# EAGLE design main (EAGLE 5.11)

## Sheet 1 of 2
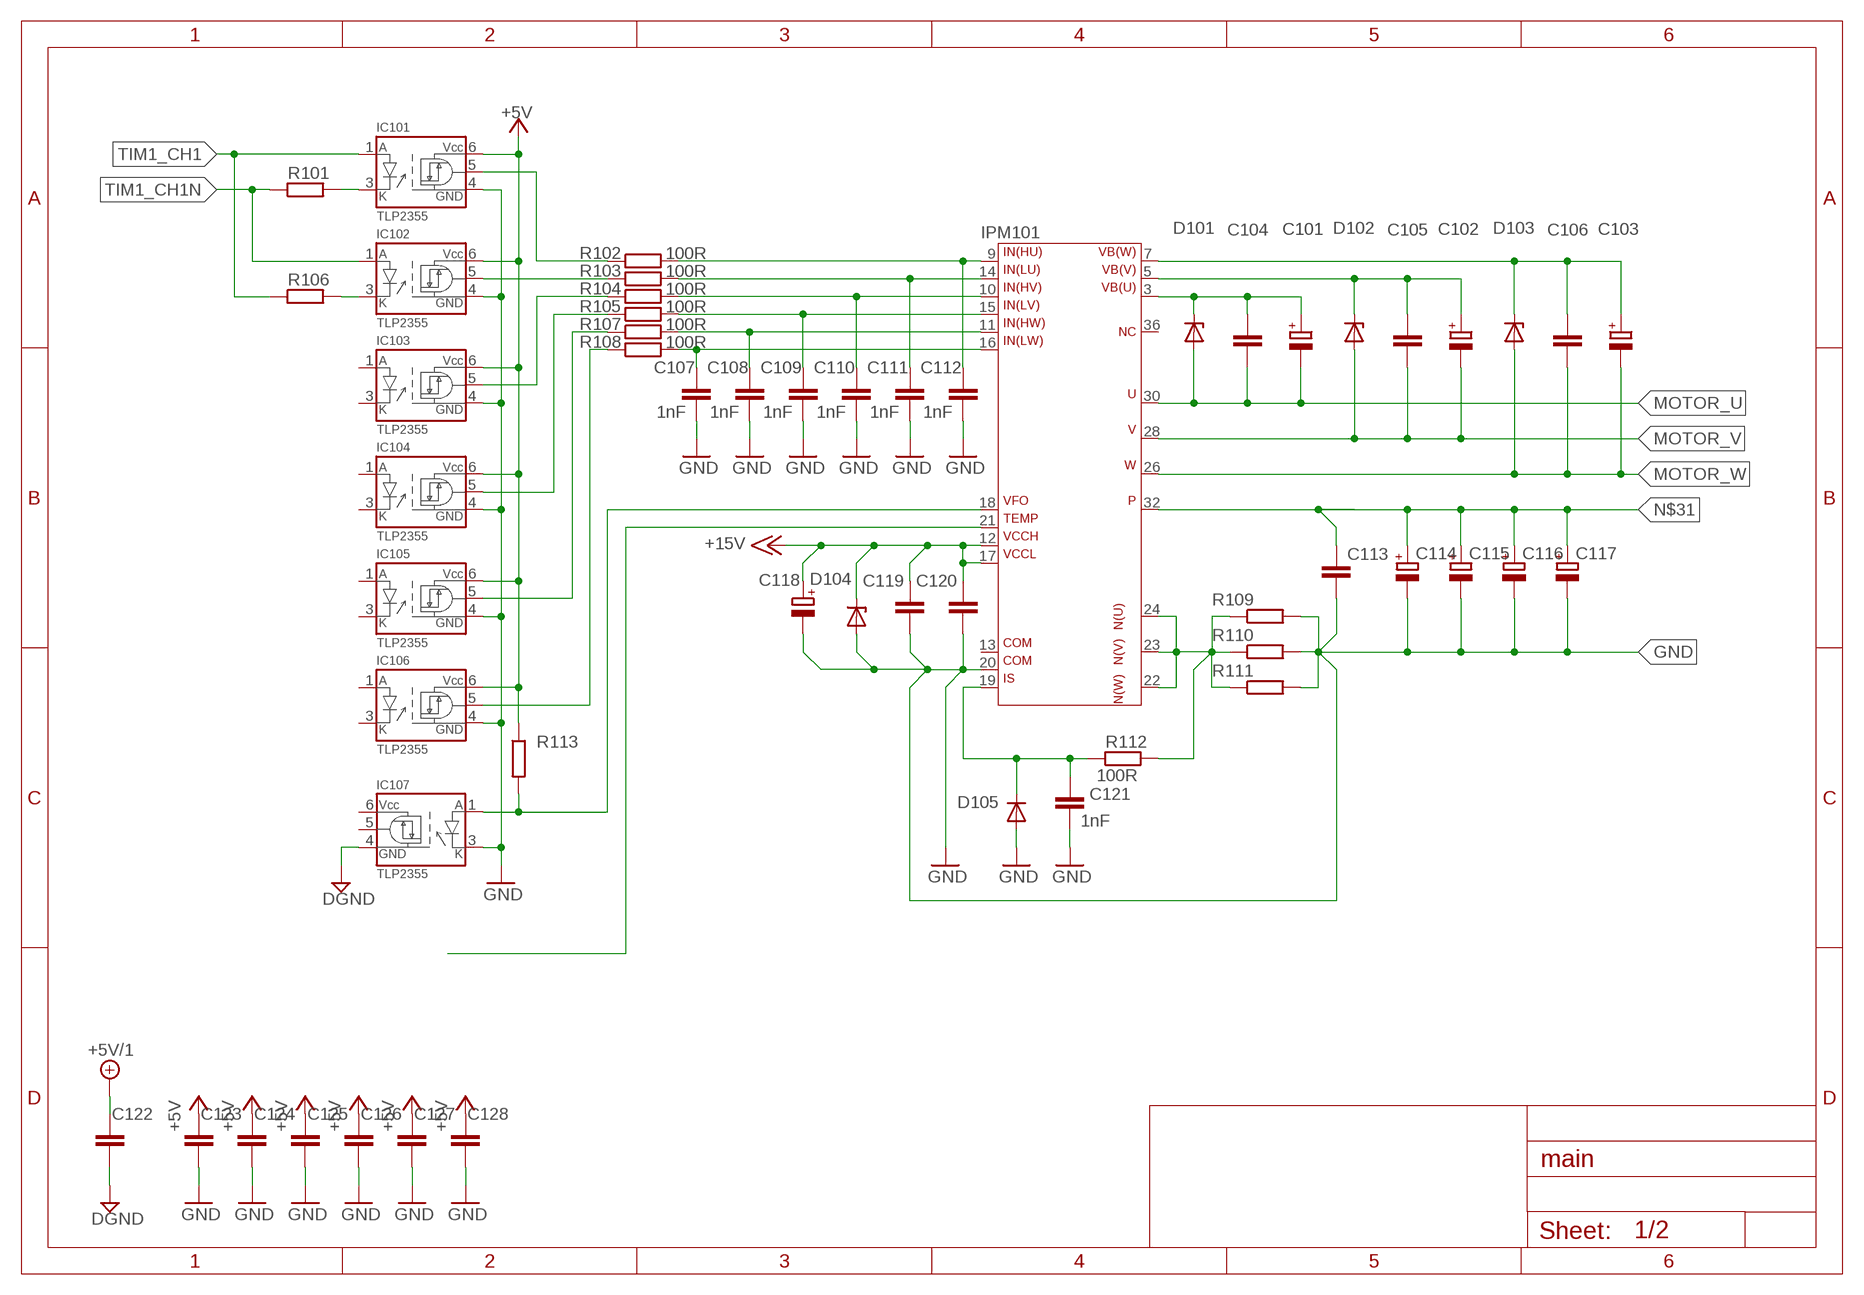
[diagram p0: schematic, sheet 1]

### Parts
C101  CPOL-EU153CLV-0405  [153CLV-0405]
C102  CPOL-EU153CLV-0405  [153CLV-0405]
C103  CPOL-EU153CLV-0405  [153CLV-0405]
C104  C-EUC0805  [C0805]
C105  C-EUC0805  [C0805]
C106  C-EUC0805  [C0805]
C107  1nF  C-EUC0805  [C0805]
C108  1nF  C-EUC0805  [C0805]
C109  1nF  C-EUC0805  [C0805]
C110  1nF  C-EUC0805  [C0805]
C111  1nF  C-EUC0805  [C0805]
C112  1nF  C-EUC0805  [C0805]
C113  C-EU225-062X268  [C225-062X268]
C114  CPOL-EUE10-22.5  [EB22,5D]
C115  CPOL-EUE10-22.5  [EB22,5D]
C116  CPOL-EUE10-22.5  [EB22,5D]
C117  CPOL-EUE10-22.5  [EB22,5D]
C118  CPOL-EU153CLV-0405  [153CLV-0405]
C119  C-EUC0805  [C0805]
C120  C-EUC0805  [C0805]
C121  1nF  C-EUC0805  [C0805]
C122  C-EUC0805  [C0805]
C123  C-EUC0805  [C0805]
C124  C-EUC0805  [C0805]
C125  C-EUC0805  [C0805]
C126  C-EUC0805  [C0805]
C127  C-EUC0805  [C0805]
C128  C-EUC0805  [C0805]
D101  ZENER-DIODESOD80C  [SOD80C]
D102  ZENER-DIODESOD80C  [SOD80C]
D103  ZENER-DIODESOD80C  [SOD80C]
D104  ZENER-DIODESOD80C  [SOD80C]
D105  DIODE-SOD123  [SOD123]
IC101  TLP2355  [11-4L1S]
IC102  TLP2355  [11-4L1S]
IC103  TLP2355  [11-4L1S]
IC104  TLP2355  [11-4L1S]
IC105  TLP2355  [11-4L1S]
IC106  TLP2355  [11-4L1S]
IC107  TLP2355  [11-4L1S]
IPM101  6MBP  [6MBPXXXSD060-50]
R101  R-EU_R0805  [R0805]
R102  100R  R-EU_R0805  [R0805]
R103  100R  R-EU_R0805  [R0805]
R104  100R  R-EU_R0805  [R0805]
R105  100R  R-EU_R0805  [R0805]
R106  R-EU_R0805  [R0805]
R107  100R  R-EU_R0805  [R0805]
R108  100R  R-EU_R0805  [R0805]
R109  R-EU_R6332W  [R6332W]
R110  R-EU_R6332W  [R6332W]
R111  R-EU_R6332W  [R6332W]
R112  100R  R-EU_R0805  [R0805]
R113  R-EU_R0805  [R0805]

### Nets
+5V: C123.1 C124.1 C125.1 C126.1 C127.1 C128.1 IC101.6(VCC) IC102.6(VCC) IC103.6(VCC) IC104.6(VCC) IC105.6(VCC) IC106.6(VCC) R113.1
+5V/1: C122.1
+15V: C118.+ C119.1 C120.1 D104.C IPM101.12 IPM101.17
DGND: C122.2 IC107.4(GND)
GND: C107.2 C108.2 C109.2 C110.2 C111.2 C112.2 C113.2 C114.- C115.- C116.- C117.- C118.- C119.2 C120.2 C121.2 C123.2 C124.2 C125.2 C126.2 C127.2 C128.2 D104.A D105.A IC101.4(GND) IC102.4(GND) IC103.4(GND) IC104.4(GND) IC105.4(GND) IC106.4(GND) IC107.3(K) IPM101.20 R109.2 R110.2 R111.2
MOTOR_U: C101.- C104.1 D101.A IPM101.30
MOTOR_V: C102.- C105.1 D102.A IPM101.28
MOTOR_W: C103.- C106.1 D103.A IPM101.26
N$7: C101.+ C104.2 D101.C IPM101.3
N$29: C102.+ C105.2 D102.C IPM101.5
N$30: C103.+ C106.2 D103.C IPM101.7
N$31: C113.1 C114.+ C115.+ C116.+ C117.+ IPM101.32
N$32: IC101.5(OUT) R102.1
N$33: IPM101.22 IPM101.23 IPM101.24 R109.1 R110.1 R111.1 R112.2
N$34: IC102.5(OUT) R103.1
N$35: C121.1 D105.C IPM101.19 R112.1
N$36: IC103.5(OUT) R104.1
N$37: IC104.5(OUT) R105.1
N$38: IC105.5(OUT) R107.1
N$39: IC106.5(OUT) R108.1
N$42: IPM101.21
N$45: IC101.3(K) R101.2
N$46: IC102.3(K) R106.2
N$47: C112.1 IPM101.9 R102.2
N$48: C111.1 IPM101.14 R103.2
N$49: C110.1 IPM101.10 R104.2
N$50: C109.1 IPM101.15 R105.2
N$51: C108.1 IPM101.11 R107.2
N$52: C107.1 IPM101.16 R108.2
N$53: IC107.1(A) IPM101.18 R113.2
TIM1_CH1: IC101.1(A) R106.1
TIM1_CH1N: IC102.1(A) R101.1
Unconnected: IC103.1(A) IC103.3(K) IC104.1(A) IC104.3(K) IC105.1(A) IC105.3(K) IC106.1(A) IC106.3(K) IC107.5(OUT) IC107.6(VCC) IPM101.36

## Sheet 2 of 2
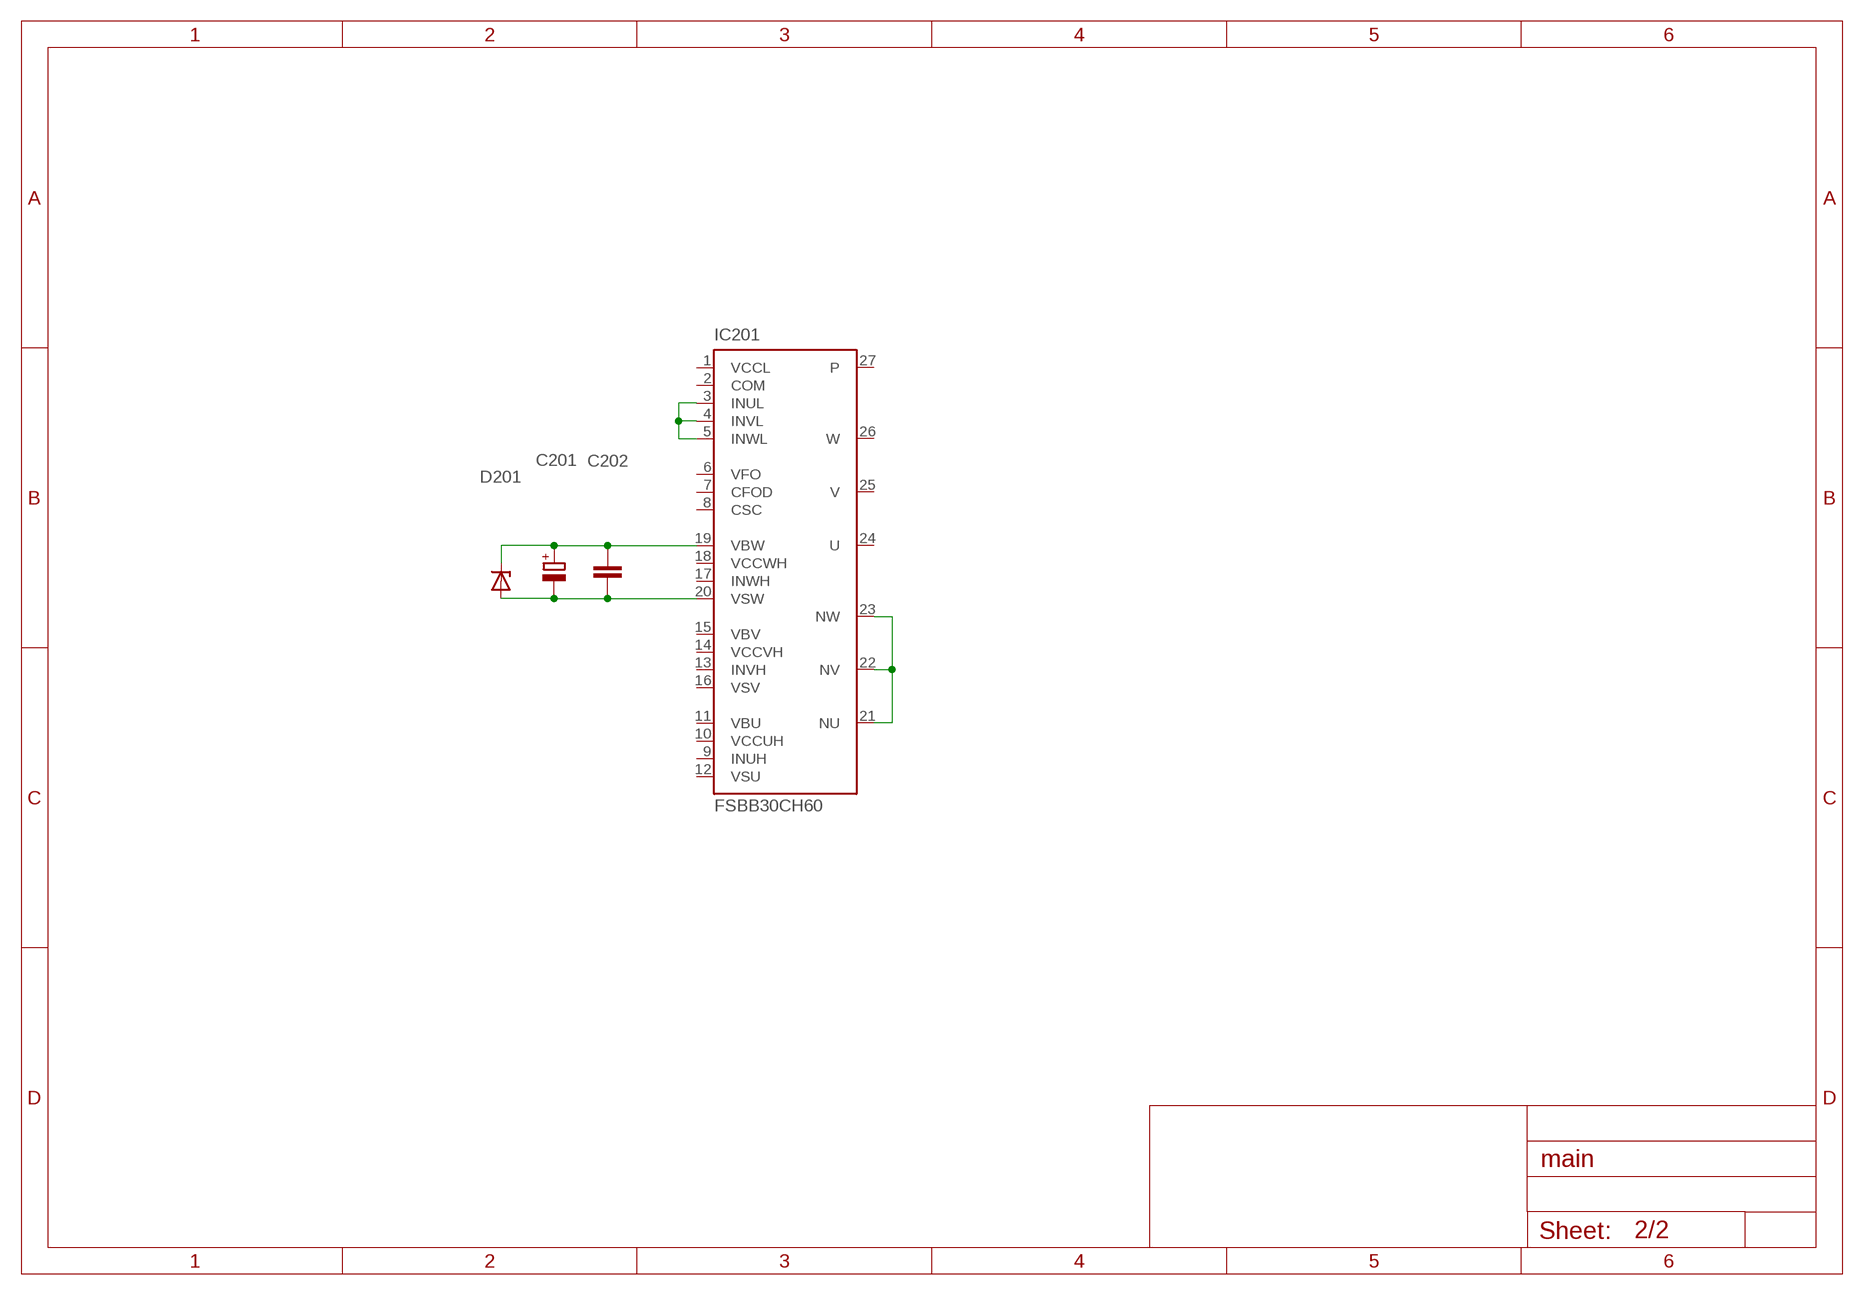
[diagram p1: schematic, sheet 2]

### Parts
C201  CPOL-EU153CLV-0405  [153CLV-0405]
C202  C-EUC0805  [C0805]
D201  ZENER-DIODESOD80C  [SOD80C]
IC201  FSBB30CH60  [FSBB30CH60]

### Nets
N$10: IC201.21(NU) IC201.22(NV) IC201.23(NW)
N$23: IC201.3(INUL) IC201.4(INVL) IC201.5(INWL)
N$24: C201.- C202.1 D201.A IC201.20(VSW)
N$25: C201.+ C202.2 D201.C IC201.19(VBW)
Unconnected: IC201.6(VFO) IC201.7(CFOD) IC201.8(CSC) IC201.9(INUH) IC201.10(VCCUH) IC201.11(VBU) IC201.12(VSU) IC201.13(INVH) IC201.14(VCCVH) IC201.15(VBV) IC201.16(VSV) IC201.17(INWH) IC201.18(VCCWH) IC201.24(U) IC201.25(V) IC201.26(W) IC201.27(P)

## Power pins joined to a net without a drawn wire
13: IPM101.13
COM: IC201.2(COM)
VCCL: IC201.1(VCCL)

## Library data of the parts
C101-C103 C114-C118 C201 = rcl:CPOL-EU: POLARIZED CAPACITOR, European symbol
C104-C113 C119-C128 C202 = rcl:C-EU: CAPACITOR, European symbol
D101-D104 D201 = diode:ZENER-DIODE: Z-Diode
D105 = diode:DIODE-: DIODE
IC101-IC107 = myToshiba:TLP2355
IC201 = fairchild-semic:FSBB30CH60: Smart Power Module 600V-30A IGBT inverter for three-phase DC/AC power conversion Source: http://www.fairchildsemi.com/ds/FS/FSBB30CH60.pdf; MPN: FSBB30CH60B; OC_FARNELL: 1783234; OC_NEWARK: 78M1076
IPM101 = myFujiElectric:6MBP
R101-R113 = rcl:R-EU_: RESISTOR, European symbol

## Board
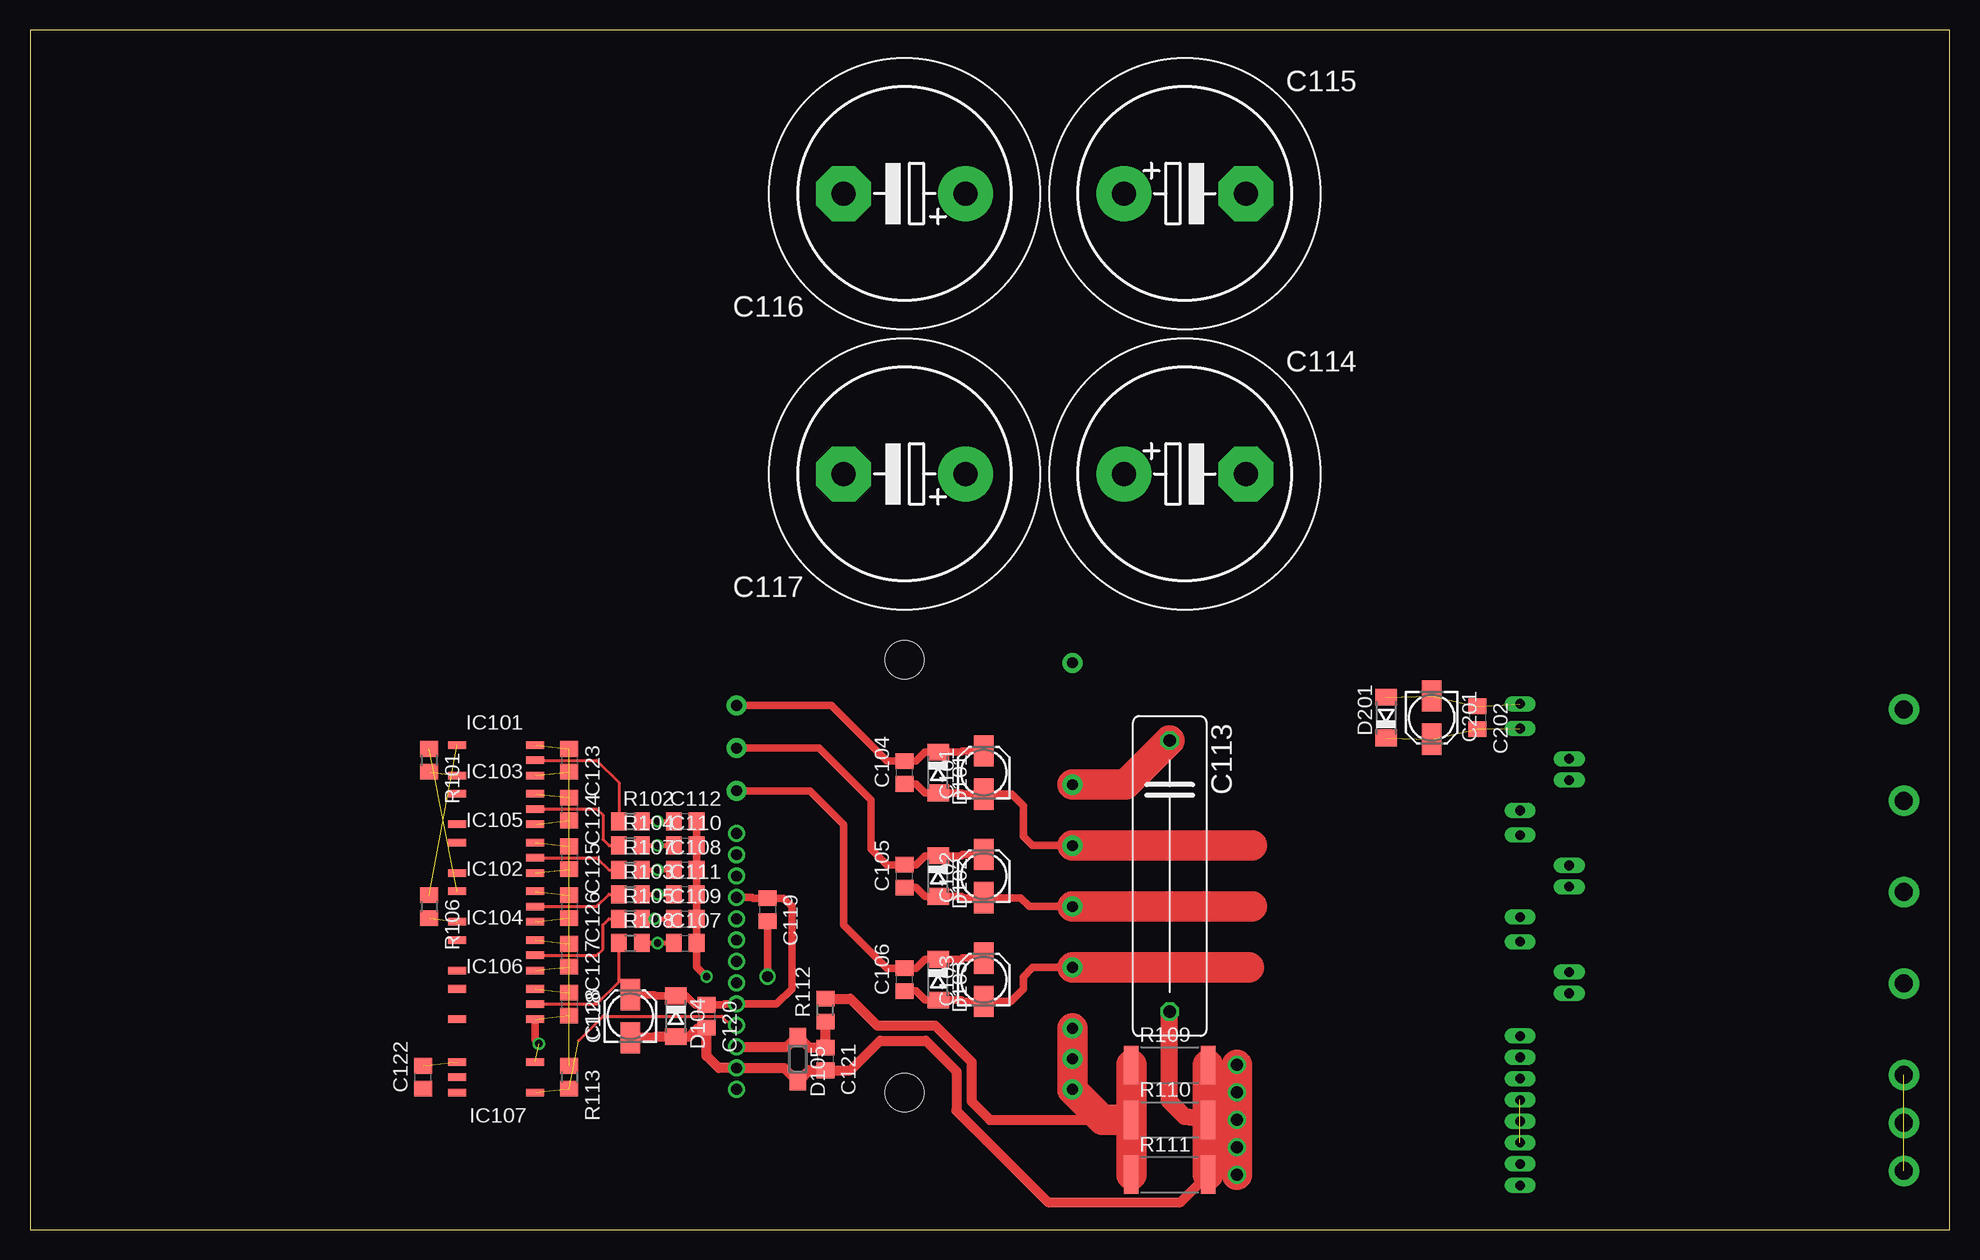
[diagram p2: board, top side]
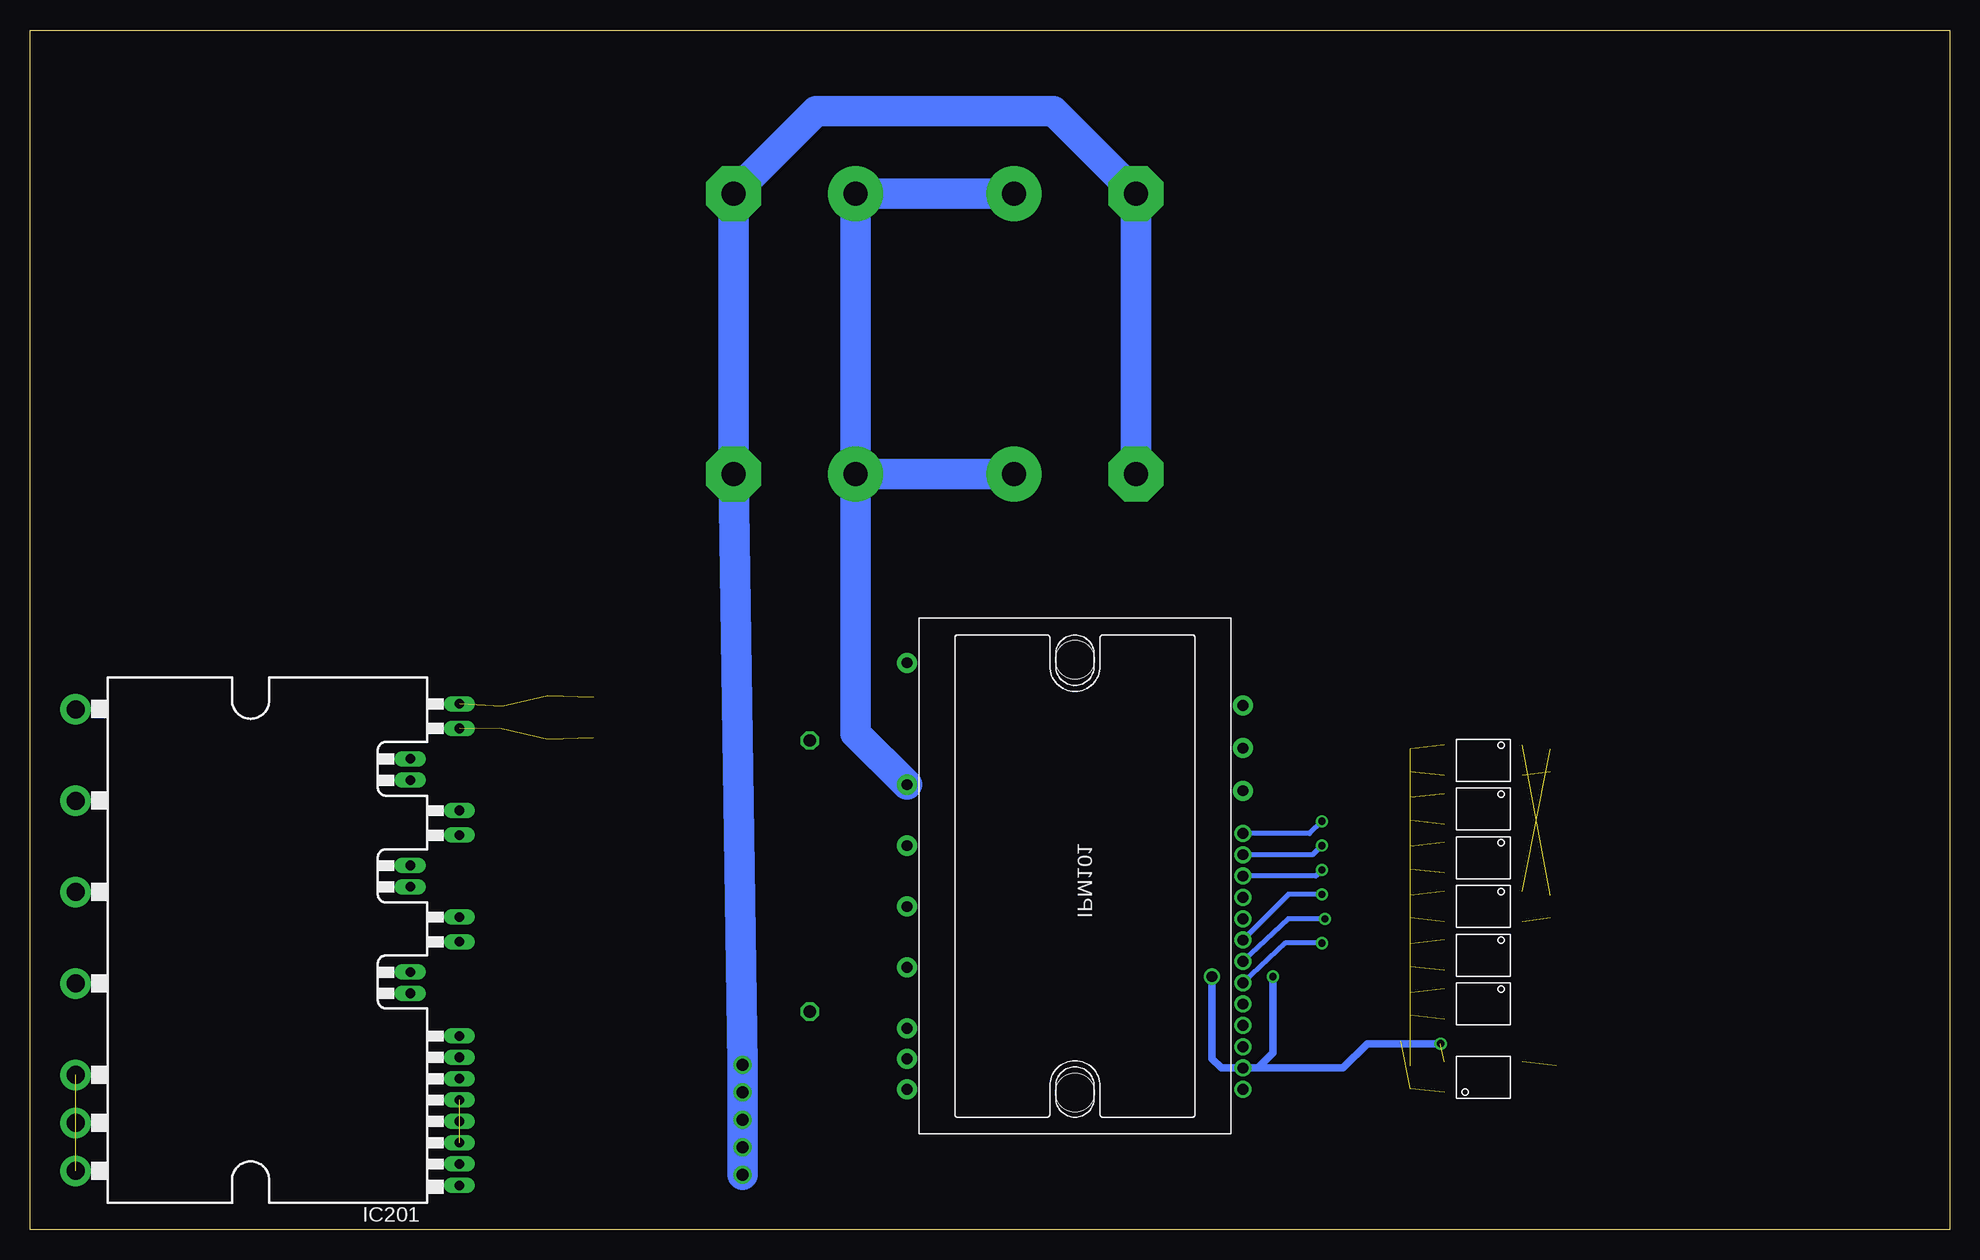
[diagram p3: board, bottom side, seen from below]

Size 160 x 100 mm. Coordinates in mm from the lower left corner, seen from the top.
Outline: 0,0 160,0 160,100 0,100 0,0
Copper layers (1*16): Top 0.035mm / dielectric 1.5mm / Bottom 0.035mm
Design rules "default": minimum track width 10mil, minimum drill 24mil, track to track 8mil, track to pad 8mil, pad to pad 8mil, via to via 8mil, smd to smd 8mil, copper to edge 40mil, drill to drill 8mil, minimum pad ring 10mil, minimum via ring 8mil, stop-mask expansion 4mil, vias tented up to drill 0mil, thermal gap 10mil
Holes 3.2 mm at 72.9,11.43 72.9,47.5

### Footprints (pad centres in the part's own frame; a part is rotated, then mirrored left to right if it is on the bottom)
153CLV-0405 = smd 2.6 x 1.6: + 1.8,0; - -1.8,0
C0805 = smd 1.3 x 1.5: 1 -0.95,0; 2 0.95,0
C225-062X268 = drill 1.016 octagon: 1 -11.303,0; 2 11.303,0
EB22,5D = drill 2.007 pad 4.597 round: + -5.08,0 | drill 2.007 pad 4.597 octagon: - 5.08,0
SOD80C = smd 1.4 x 1.8: A 1.7,0; C -1.7,0
SOD123 = smd 1.4 x 1.4: A 1.9,0; C -1.9,0
11-4L1S = smd 0.635 x 1.5: 1 -1.27,-3.25; 3 1.27,-3.25; 4 1.27,3.25; 5 0,3.25; 6 -1.27,3.25
FSBB30CH60 = drill 0.8 pad 1.27 long: 1 -20.447,-16; 2 -18.669,-16; 3 -16.891,-16; 4 -15.113,-16; 5 -13.335,-16; 6 -11.557,-16; 7 -9.779,-16; 8 -8.001,-16; 9 -4.445,-11.9; 10 -2.667,-11.9; 11 -0.136,-16; 12 1.914,-16; 13 4.445,-11.9; 14 6.223,-11.9; 15 8.754,-16; 16 10.804,-16; 17 13.335,-11.9; 18 15.113,-11.9; 19 17.644,-16; 20 19.694,-16 | drill 1.5 pad 2.54 round: 21 -19.24,16; 22 -15.24,16; 23 -11.24,16; 24 -3.62,16; 25 4,16; 26 11.62,16; 27 19.24,16
6MBPXXXSD060-50 = drill 0.9 pad 1.676 round: 3 14.224,14; 5 10.668,14; 7 7.112,14; 22 -17.78,-14; 23 -15.24,-14; 24 -12.7,-14; 26 -7.62,-14; 28 -2.54,-14; 30 2.54,-14; 32 7.62,-14; 36 17.78,-14 | drill 0.9 pad 1.422 round: 9 3.556,14; 10 1.778,14; 11 0,14; 12 -1.778,14; 13 -3.556,14; 14 -5.334,14; 15 -7.112,14; 16 -8.89,14; 17 -10.668,14; 18 -12.446,14; 19 -14.224,14; 20 -16.002,14; 21 -17.78,14
R0805 = smd 1.3 x 1.5: 1 -0.95,0; 2 0.95,0
R6332W = smd 1.2 x 3.2: 1 -3.196,0; 2 3.196,0

### Placement (x,y rotation side)
C101  79.5,38.1 90 top
C102  79.5,29.46 90 top
C103  79.5,20.83 90 top
C104  72.9,38.1 90 top
C105  72.9,29.46 90 top
C106  72.9,20.83 90 top
C107  54.61,23.88 0 top
C108  54.61,29.97 0 top
C109  54.61,25.91 0 top
C110  54.61,32 0 top
C111  54.61,27.94 0 top
C112  54.61,34.04 0 top
C113  95,29.46 270 top
C114  96.27,62.99 0 top
C115  96.27,86.36 0 top
C116  72.9,86.36 180 top
C117  72.9,62.99 180 top
C118  50.04,17.78 90 top
C119  61.47,26.67 270 top
C120  56.39,17.78 270 top
C121  66.29,14.22 270 top
C122  32.77,12.7 90 top
C123  44.96,39.12 270 top
C124  44.96,35.05 270 top
C125  44.96,30.99 270 top
C126  44.96,26.92 270 top
C127  44.96,22.86 270 top
C128  44.96,18.8 270 top
C201  116.84,42.67 270 top
C202  120.65,42.67 270 top
D101  75.69,38.1 270 top
D102  75.69,29.46 270 top
D103  75.69,20.83 270 top
D104  53.85,17.78 270 top
D105  64.01,14.22 270 top
D201  113.03,42.67 90 top
IC101  38.86,39.12 270 top
IC102  38.86,26.92 270 top
IC103  38.86,35.05 270 top
IC104  38.86,22.86 270 top
IC105  38.86,30.99 270 top
IC106  38.86,18.8 270 top
IC107  38.86,12.7 90 top
IC201  140.21,24.13 90 bottom
IPM101  72.9,29.46 90 top
R101  33.27,39.12 270 top
R102  50.04,34.04 0 top
R103  50.04,27.94 0 top
R104  50.04,32 0 top
R105  50.04,25.91 0 top
R106  33.27,26.92 270 top
R107  50.04,29.97 0 top
R108  50.04,23.88 0 top
R109  95,13.72 0 top
R110  95,9.14 0 top
R111  95,4.57 0 top
R112  66.29,18.29 90 top
R113  44.96,12.7 270 top

### Tracks (layer width: path | path; a pad name or v marks a point on that pad's centre or on a via)
+5V  (12 unrouted)
+15V
  Top 0.61: C118.+ 52.05,19.58 52.15,19.48 D104.C 54.69,19.48 55.44,18.73 C120.1 57.85,18.73 57.91,18.8 IPM101.17 62.23,18.8 63.5,20.07 63.5,26.92 62.8,27.62 C119.1 60.26,27.62 60.2,27.69 IPM101.12
DGND  (1 unrouted)
GND  (via drill 0.6, 0.9, 1)  (12 unrouted)
  Top 0.61: v56.39,21.08 55.56,21.91 C107.2 C109.2 C111.2 C108.2 C110.2 C112.2 | IC106.4 42.11,15.8 v42.42,15.49 | v61.47,21.08 C119.2
  Top 0.813: 56.39,16.76 C120.2 | C118.- 52.05,15.98 52.15,16.08 D104.A 54.94,16.08 55.63,16.76 56.39,16.76 | 56.39,16.76 56.39,14.48 57.4,13.46 IPM101.20 62.87,13.46 D105.A 64.96,13.27 C121.2 68.39,13.27 70.87,15.75 74.68,15.75 77.22,13.21 77.22,9.91 84.84,2.29 95.91,2.29 R111.2
  Top 1.422: C113.2 95,10.67 96.27,9.4 R110.2 v100.58,9.14
  Top 2.54: v100.58,13.72 v100.58,9.14 v100.58,4.57 | R109.2 R110.2 R111.2
  Bottom 0.61: v56.39,21.08 56.39,14.73 57.66,13.46 | v42.42,15.49 48.51,15.49 50.55,13.46 57.66,13.46 | 57.66,13.46 IPM101.20 60.71,13.46 61.47,14.22 v61.47,21.08
  Bottom 2.54: C117.- C116.- 74.68,93.22 94.49,93.22 C115.- C114.- v100.58,13.72 v100.58,11.43 v100.58,9.14 v100.58,6.86 v100.58,4.57
MOTOR_U
  Top 0.61: IPM101.30 83.57,32 82.8,32.77 82.8,35.31 81.81,36.3 C101.- 77.75,36.3 77.65,36.4 D101.A 74.6,36.4 73.85,37.15 C104.1
  Top 2.54: IPM101.30 101.85,32
MOTOR_V
  Top 0.61: IPM101.28 83.31,26.92 82.57,27.66 C102.- 77.75,27.66 77.65,27.76 D102.A 74.6,27.76 73.85,28.51 C105.1
  Top 2.54: IPM101.28 101.85,26.92
MOTOR_W
  Top 0.61: IPM101.26 83.57,21.84 82.8,21.08 82.8,20.07 81.77,19.03 C103.- 77.75,19.03 77.65,19.13 D103.A 74.6,19.13 73.85,19.88 C106.1
  Top 2.54: IPM101.26 101.6,21.84
N$7
  Top 0.61: C101.+ 77.75,39.9 77.65,39.8 D101.C 74.6,39.8 73.85,39.05 C104.2 71.44,39.05 66.8,43.69 IPM101.3
N$10  (2 unrouted)
N$23  (2 unrouted)
N$24  (3 unrouted)
N$25  (3 unrouted)
N$29
  Top 0.61: C102.+ 77.75,31.26 77.65,31.16 D102.C 74.6,31.16 73.85,30.41 C105.2 71.44,30.41 70.1,31.75 70.1,35.81 65.79,40.13 IPM101.5
N$30
  Top 0.61: C103.+ 77.75,22.63 77.65,22.53 D103.C 74.6,22.53 73.85,21.78 C106.2 71.44,21.78 67.82,25.4 67.82,33.78 65.02,36.58 IPM101.7
N$31
  Top 2.54: IPM101.32 91.31,37.08 C113.1
  Bottom 2.54: C114.+ C115.+ C116.+ | C114.+ C117.+ | C114.+ 91.19,41.37 IPM101.32
N$32
  Top 0.254: R102.1 49.09,37.27 47.24,39.12 IC101.5
N$33
  Top 0.813: R112.2 68.39,19.24 70.61,17.02 75.44,17.02 78.49,13.97 78.49,10.67 80.01,9.14 89.41,9.14
  Top 2.54: IPM101.24 IPM101.23 IPM101.22 86.9,11.65 89.41,9.14 R110.1 | R110.1 R109.1 | R110.1 R111.1
N$34
  Top 0.254: R103.1 48.26,27.94 47.24,26.92 IC102.5
N$35
  Top 0.813: R112.1 C121.1 64.96,15.17 D105.C 63.12,15.24 IPM101.19
N$36
  Top 0.254: R104.1 48.26,32 47.75,32.51 47.75,34.54 47.24,35.05 IC103.5
N$37
  Top 0.254: R105.1 48.26,25.91 47.75,25.4 47.75,23.37 47.24,22.86 IC104.5
N$38
  Top 0.254: R107.1 48.26,29.97 47.24,30.99 IC105.5
N$39
  Top 0.254: R108.1 49.09,20.64 47.24,18.8 IC106.5
N$45  (1 unrouted)
N$46  (1 unrouted)
N$47  (via drill 0.6)
  Top 0.406: R102.2 v52.32,34.04 C112.1
  Bottom 0.406: IPM101.9 53.34,33.02 v52.32,34.04
N$48  (via drill 0.6)
  Top 0.406: R103.2 v52.32,27.94 C111.1
  Bottom 0.406: IPM101.14 55.12,27.94 v52.32,27.94
N$49  (via drill 0.6)
  Top 0.406: R104.2 v52.32,32 C110.1
  Bottom 0.406: IPM101.10 53.09,31.24 v52.32,32
N$50  (via drill 0.6)
  Top 0.406: C109.1 v52.07,25.91 R105.2
  Bottom 0.406: IPM101.15 55.12,25.91 v52.07,25.91
N$51  (via drill 0.6)
  Top 0.406: R107.2 v52.32,29.97 C108.1
  Bottom 0.406: v52.32,29.97 52.83,29.46 IPM101.11
N$52  (via drill 0.6)
  Top 0.406: C107.1 v52.32,23.88 R108.2
  Bottom 0.406: IPM101.16 55.37,23.88 v52.32,23.88
N$53  (2 unrouted)
  Top 0.254: IPM101.18 58.42,17.02 57.66,17.78 47.75,17.78 45.72,15.75
TIM1_CH1  (1 unrouted)
TIM1_CH1N  (1 unrouted)